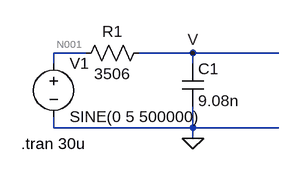
[diagram p0: schematic Draft2.asc]
Draft2.asc, the LTspice schematic file:
Version 4
SHEET 1 880 680
WIRE 64 80 16 80
WIRE 224 80 144 80
WIRE 352 80 224 80
WIRE 16 96 16 80
WIRE 224 96 224 80
WIRE 16 192 16 176
WIRE 224 192 224 160
WIRE 224 192 16 192
WIRE 352 192 224 192
WIRE 224 208 224 192
FLAG 224 208 0
FLAG 224 80 V
SYMBOL res 160 64 R90
WINDOW 0 0 56 VBottom 2
WINDOW 3 32 56 VTop 2
SYMATTR InstName R1
SYMATTR Value 3506
SYMBOL cap 208 96 R0
SYMATTR InstName C1
SYMATTR Value 9.08n
SYMBOL voltage 16 80 R0
WINDOW 123 0 0 Left 0
WINDOW 39 0 0 Left 0
SYMATTR InstName V1
SYMATTR Value SINE(0 5 500000)
TEXT -32 216 Left 2 !.tran 30u

The netlist it stands for:
* Draft2.asc
R1 V N001 3506
C1 V 0 9.08n
V1 N001 0 SINE(0 5 500000)
.tran 30u
.backanno
.end

* Results of the author's LTspice run, read from the files saved beside the schematic
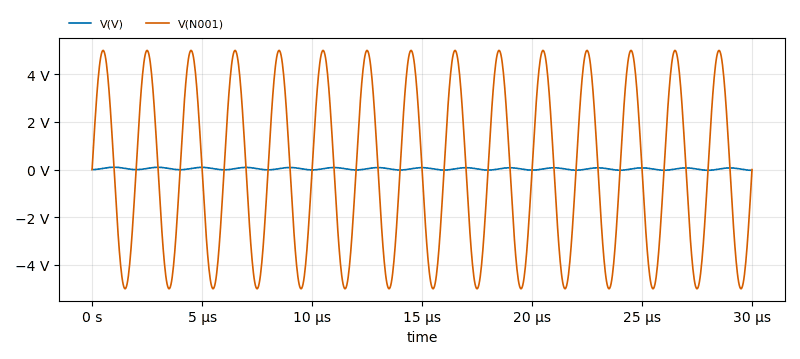
[diagram p1: Transient Analysis of Draft2.asc, plotted from the saved traces]
* Transient Analysis, 1 run:
*   V(V): min -30.49 mV, max 98.24 mV, average 32.35 mV, rms 48.64 mV, last -30.49 mV
*   V(N001): min -5 V, max 5 V, average 0 V, rms 3.536 V, last 0 V